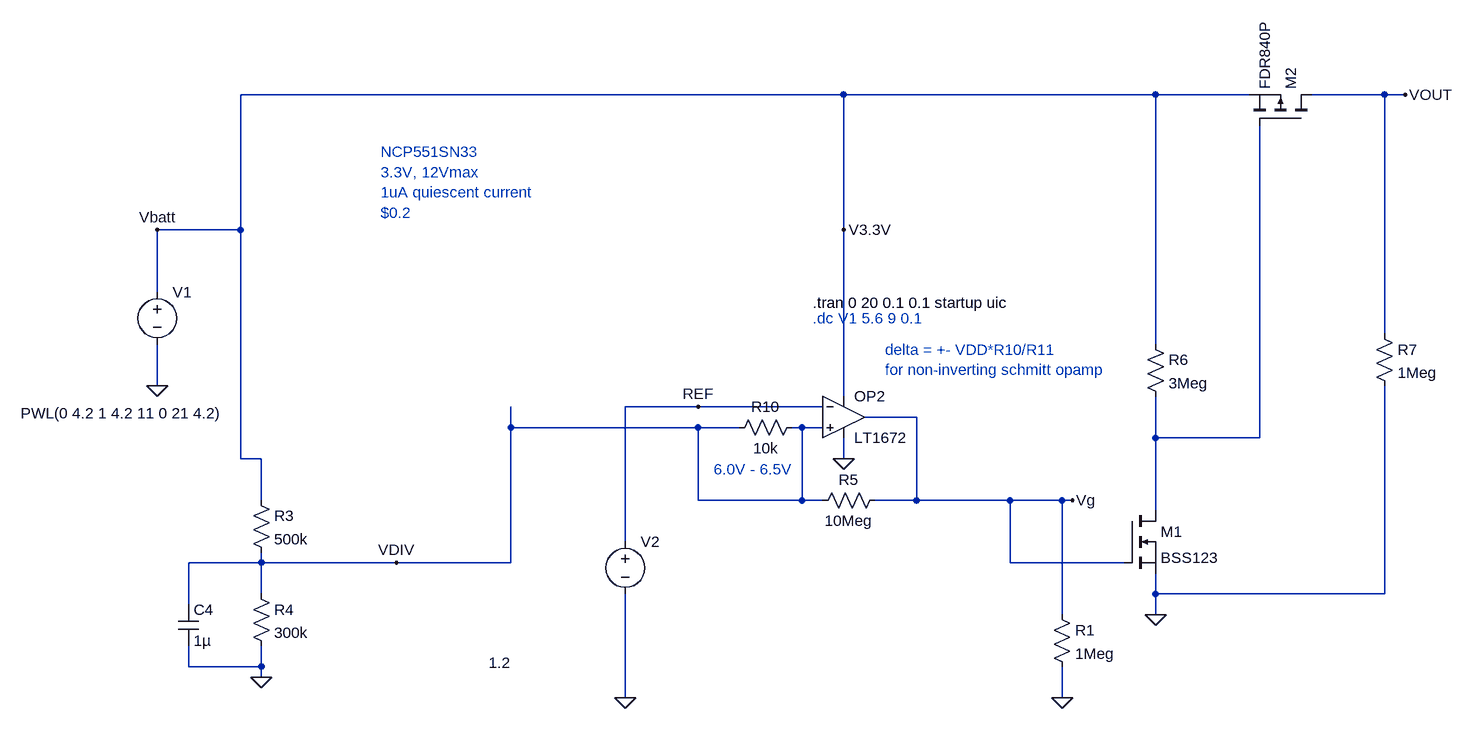
[diagram p0: schematic LV protection.asc]
LV protection.asc, the LTspice schematic file:
Version 4
SHEET 1 1936 1076
WIRE 992 -320 64 -320
WIRE 1472 -320 992 -320
WIRE 1616 -320 1472 -320
WIRE 1824 -320 1712 -320
WIRE 1856 -320 1824 -320
WIRE 64 -112 64 -320
WIRE 64 -112 -64 -112
WIRE 992 -112 992 -320
WIRE -64 -16 -64 -112
WIRE 1824 48 1824 -320
WIRE 1472 64 1472 -320
WIRE -64 128 -64 64
WIRE 992 144 992 -112
WIRE 768 160 656 160
WIRE 960 160 768 160
WIRE 1104 176 1024 176
WIRE 480 192 480 160
WIRE 768 192 480 192
WIRE 832 192 768 192
WIRE 928 192 912 192
WIRE 960 192 928 192
WIRE 1472 208 1472 144
WIRE 1632 208 1632 -272
WIRE 1632 208 1472 208
WIRE 64 240 64 -112
WIRE 96 240 64 240
WIRE 992 240 992 208
WIRE 96 304 96 240
WIRE 768 304 768 192
WIRE 928 304 928 192
WIRE 928 304 768 304
WIRE 960 304 928 304
WIRE 1104 304 1104 176
WIRE 1104 304 1040 304
WIRE 1248 304 1104 304
WIRE 1328 304 1248 304
WIRE 1344 304 1328 304
WIRE 1472 320 1472 208
WIRE 656 368 656 160
WIRE 96 400 96 384
WIRE 96 400 -16 400
WIRE 304 400 96 400
WIRE 480 400 480 192
WIRE 480 400 304 400
WIRE 1248 400 1248 304
WIRE 1424 400 1248 400
WIRE 96 448 96 400
WIRE 1472 448 1472 416
WIRE 1824 448 1824 128
WIRE 1824 448 1472 448
WIRE -16 464 -16 400
WIRE 1328 480 1328 304
WIRE 1472 480 1472 448
WIRE -16 560 -16 528
WIRE 96 560 96 528
WIRE 96 560 -16 560
WIRE 96 576 96 560
WIRE 656 608 656 448
WIRE 1328 608 1328 560
FLAG -64 128 0
FLAG -64 -112 Vbatt
FLAG 992 240 0
FLAG 992 -112 V3.3V
FLAG 1344 304 Vg
FLAG 96 576 0
FLAG 1472 480 0
FLAG 1856 -320 VOUT
FLAG 768 160 REF
FLAG 304 400 VDIV
FLAG 656 608 0
FLAG 1328 608 0
SYMBOL voltage -64 -32 R0
WINDOW 3 -210 202 Left 2
WINDOW 123 0 0 Left 0
WINDOW 39 0 0 Left 0
SYMATTR Value PWL(0 4.2 1 4.2 11 0 21 4.2)
SYMATTR InstName V1
SYMBOL Opamps/LT1672 992 176 R0
SYMATTR InstName OP2
SYMBOL res 928 176 R90
WINDOW 0 0 56 VBottom 2
WINDOW 3 32 56 VTop 2
SYMATTR InstName R10
SYMATTR Value 10k
SYMBOL res 80 288 R0
SYMATTR InstName R3
SYMATTR Value 500k
SYMBOL res 80 432 R0
SYMATTR InstName R4
SYMATTR Value 300k
SYMBOL res 1056 288 R90
WINDOW 0 0 56 VBottom 2
WINDOW 3 32 56 VTop 2
SYMATTR InstName R5
SYMATTR Value 10Meg
SYMBOL nmos 1424 320 R0
SYMATTR InstName M1
SYMATTR Value BSS123
SYMBOL res 1456 48 R0
SYMATTR InstName R6
SYMATTR Value 3Meg
SYMBOL pmos 1712 -272 M270
SYMATTR InstName M2
SYMATTR Value FDR840P
SYMBOL res 1808 32 R0
SYMATTR InstName R7
SYMATTR Value 1Meg
SYMBOL cap -32 464 R0
SYMATTR InstName C4
SYMATTR Value 1µ
SYMBOL voltage 656 352 R0
WINDOW 3 -210 202 Left 2
WINDOW 123 0 0 Left 0
WINDOW 39 0 0 Left 0
SYMATTR Value 1.2
SYMATTR InstName V2
SYMBOL res 1312 464 R0
SYMATTR InstName R1
SYMATTR Value 1Meg
TEXT 944 0 Left 2 !.tran 0 20 0.1 0.1 startup uic
TEXT 944 24 Left 2 ;.dc V1 5.6 9 0.1
TEXT 280 -232 Left 2 ;NCP551SN33\n3.3V, 12Vmax\n1uA quiescent current\n$0.2
TEXT 792 256 Left 2 ;6.0V - 6.5V
TEXT 1056 72 Left 2 ;delta = +- VDD*R10/R11\nfor non-inverting schmitt opamp

The netlist it stands for:
* LV protection.asc
V1 V3.3V 0 PWL(0 4.2 1 4.2 11 0 21 4.2)
* OP2: LT1672 (symbol Opamps/LT1672 not available, pins judged from their places): In+=VDIV In-=REF V+=V3.3V V-=0 OUT=Vg
R10 VDIV VDIV 10k
R3 V3.3V VDIV 500k
R4 VDIV 0 300k
R5 Vg VDIV 10Meg
M1 N001 Vg 0 0 BSS123
R6 V3.3V N001 3Meg
M2 VOUT N001 V3.3V V3.3V FDR840P
R7 VOUT 0 1Meg
C4 VDIV 0 1µ
V2 REF 0 1.2
R1 Vg 0 1Meg
.model NMOS NMOS
.model PMOS PMOS
.lib standard.mos
.tran 0 20 0.1 0.1 startup uic
* .dc V1 5.6 9 0.1
* NCP551SN33
* 3.3V, 12Vmax
* 1uA quiescent current
* $0.2
* 6.0V - 6.5V
* delta = +- VDD*R10/R11
* for non-inverting schmitt opamp
.backanno
.end